# EAGLE design PIN2DMD_PWR (EAGLE 7.4.0)
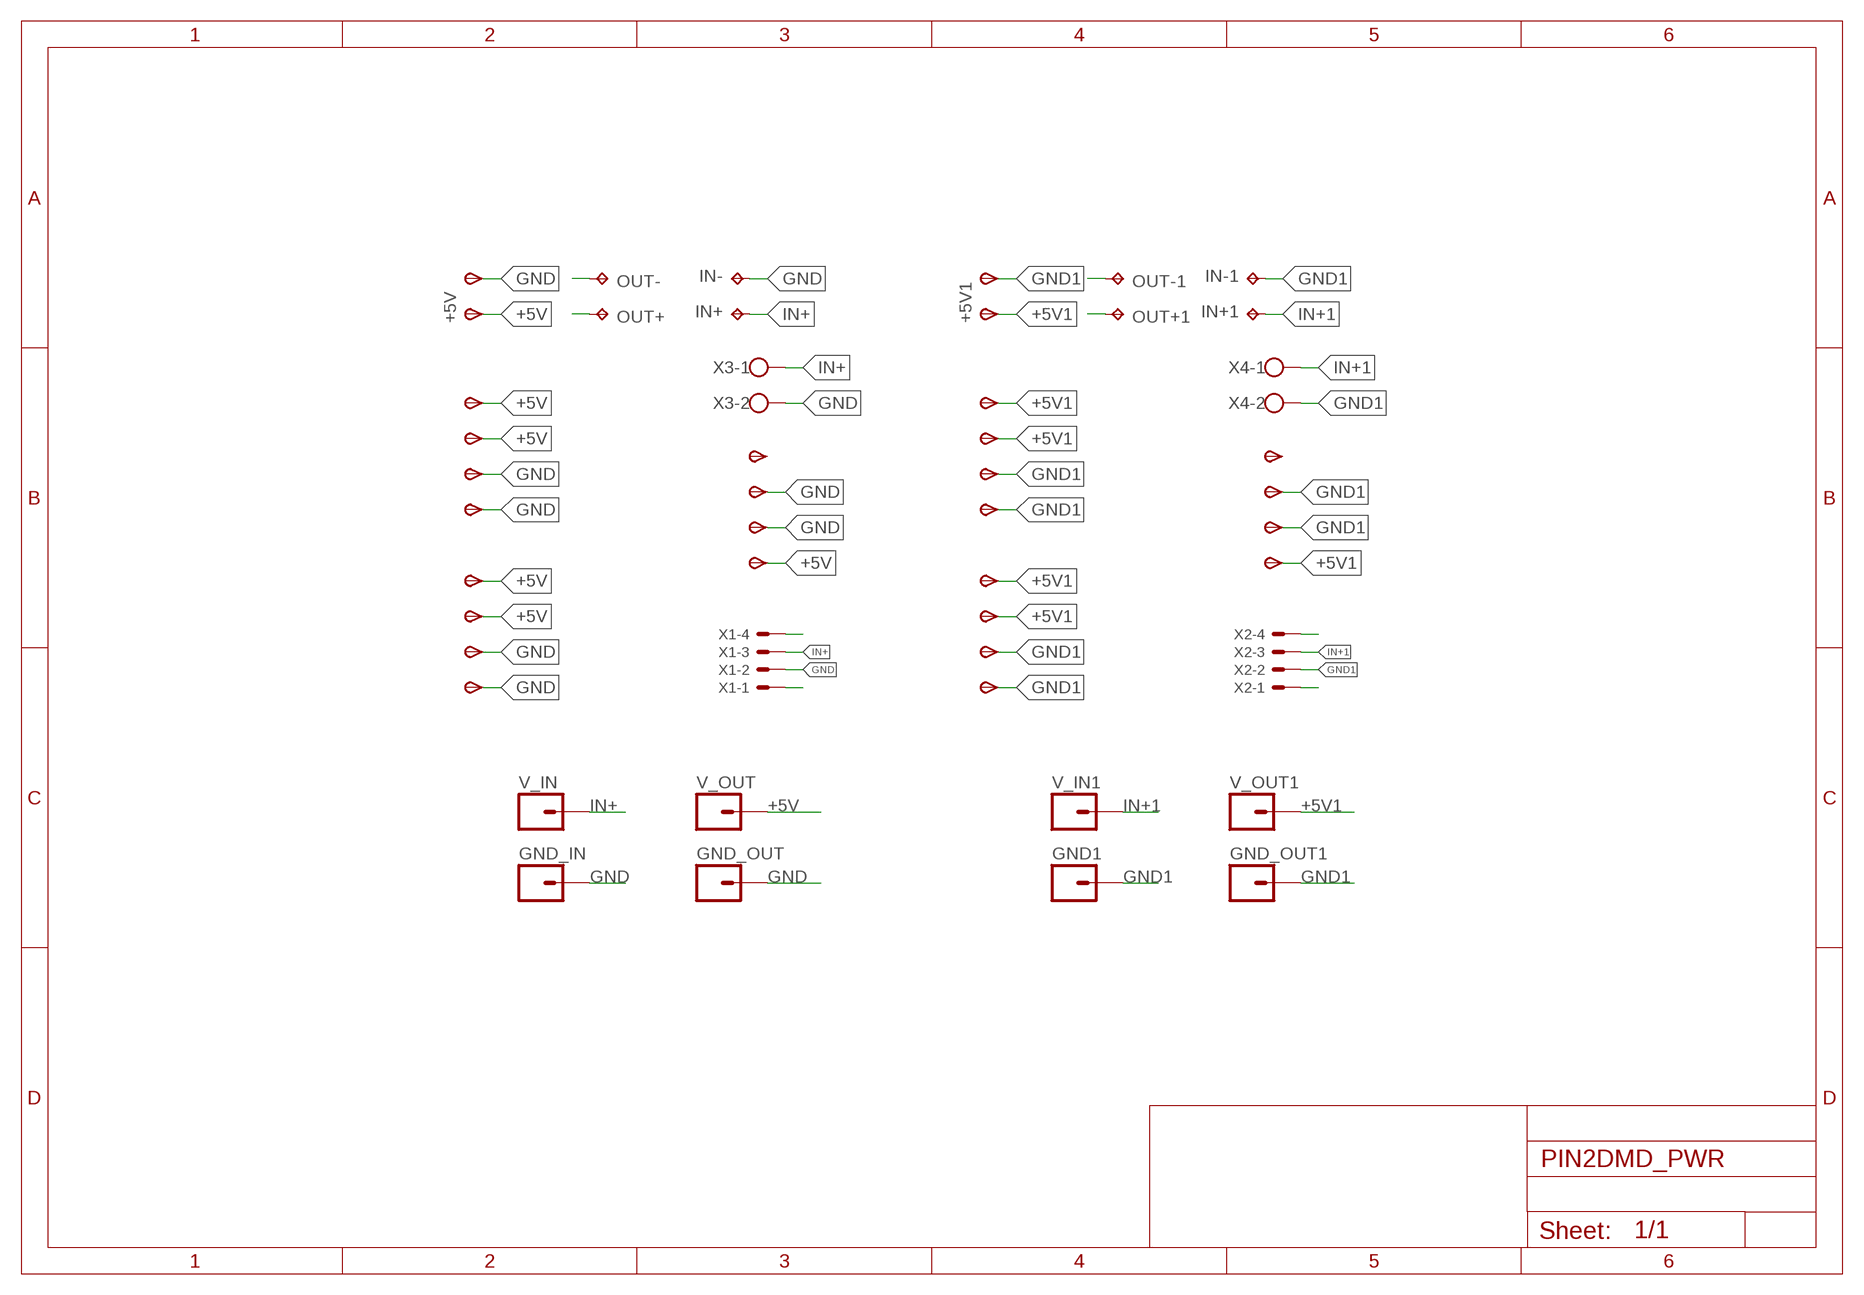
[diagram p0: schematic, sheet 1]

## Parts
+5V  TPSPAD1-20Y  [P1-20Y]
+5V1  TPSPAD1-20Y  [P1-20Y]
GND1  M01PTH  [1X01]
GND_IN  M01PTH  [1X01]
GND_OUT  M01PTH  [1X01]
GND_OUT1  M01PTH  [1X01]
IN+  TPPAD1-20  [P1-20]
IN+1  TPPAD1-20  [P1-20]
IN-  TPPAD1-20  [P1-20]
IN-1  TPPAD1-20  [P1-20]
OUT+  TPPAD1-20  [P1-20]
OUT+1  TPPAD1-20  [P1-20]
OUT-  TPPAD1-20  [P1-20]
OUT-1  TPPAD1-20  [P1-20]
TP1  TPSPAD1-20Y  [P1-20Y]
TP2  TPSPAD1-20Y  [P1-20Y]
TP3  TPSPAD1-20Y  [P1-20Y]
TP4  TPSPAD1-20Y  [P1-20Y]
TP5  TPSPAD1-20Y  [P1-20Y]
TP6  TPSPAD1-20Y  [P1-20Y]
TP7  TPSPAD1-20Y  [P1-20Y]
TP8  TPSPAD1-20Y  [P1-20Y]
TP9  TPSPAD1-20Y  [P1-20Y]
TP10  TPSPAD1-20Y  [P1-20Y]
TP11  TPSPAD1-20Y  [P1-20Y]
TP12  TPSPAD1-20Y  [P1-20Y]
TP13  TPSPAD1-20Y  [P1-20Y]
TP14  TPSPAD1-20Y  [P1-20Y]
TP15  TPSPAD1-20Y  [P1-20Y]
TP16  TPSPAD1-20Y  [P1-20Y]
TP17  TPSPAD1-20Y  [P1-20Y]
TP18  TPSPAD1-20Y  [P1-20Y]
TP19  TPSPAD1-20Y  [P1-20Y]
TP20  TPSPAD1-20Y  [P1-20Y]
TP21  TPSPAD1-20Y  [P1-20Y]
TP22  TPSPAD1-20Y  [P1-20Y]
TP23  TPSPAD1-20Y  [P1-20Y]
TP24  TPSPAD1-20Y  [P1-20Y]
TP25  TPSPAD1-20Y  [P1-20Y]
TP26  TPSPAD1-20Y  [P1-20Y]
V_IN  M01PTH  [1X01]
V_IN1  M01PTH  [1X01]
V_OUT  M01PTH  [1X01]
V_OUT1  M01PTH  [1X01]
X1  KK-156-4  [KK-156-4]
X2  KK-156-4  [KK-156-4]
X3  W237-102  [W237-102]
X4  W237-102  [W237-102]

## Nets
+5V: +5V.TP(PP) OUT+.TP TP5.TP(PP) TP6.TP(PP) TP7.TP(PP) TP8.TP(PP) TP13.TP(PP) V_OUT.1
+5V1: +5V1.TP(PP) OUT+1.TP TP17.TP(PP) TP18.TP(PP) TP19.TP(PP) TP20.TP(PP) TP26.TP(PP) V_OUT1.1
GND: GND_IN.1 GND_OUT.1 IN-.TP OUT-.TP TP1.TP(PP) TP3.TP(PP) TP4.TP(PP) TP9.TP(PP) TP10.TP(PP) TP11.TP(PP) TP12.TP(PP) X1.2 X3.2
GND1: GND1.1 GND_OUT1.1 IN-1.TP OUT-1.TP TP14.TP(PP) TP15.TP(PP) TP16.TP(PP) TP21.TP(PP) TP22.TP(PP) TP24.TP(PP) TP25.TP(PP) X2.2 X4.2
IN+: IN+.TP V_IN.1 X1.3 X3.1
IN+1: IN+1.TP V_IN1.1 X2.3 X4.1
N$1: X1.1
N$2: X2.1
N$3: X2.4
N$4: X1.4
Unconnected: TP2.TP(PP) TP23.TP(PP)

## Library data of the parts
+5V +5V1 TP1-TP26 = testpad:TPS: TEST PIN
GND1 GND_IN GND_OUT GND_OUT1 V_IN V_IN1 V_OUT V_OUT1 = SparkFun-Connectors:M01: Header 1 Standard 1-pin 0.1" header. Use with straight break away headers (SKU : PRT-00116), right angle break away headers (PRT-00553), swiss pins (PRT-00743), machine pins (PRT-00117), and female headers (PRT-00115). SMTSO-256-ET is a "flush mount" nut for a 4-40 screw. The older package used to be too tight, and did not allow it to sit properly thru the drill hit. The latest (0.165DIA) fits nice and snug.
IN+ IN+1 IN- IN-1 OUT+ OUT+1 OUT- OUT-1 = testpad:TP: Test pad
X1 X2 = con-molex:KK-156-4: KK 156 HEADER Source: http://www.molex.com/pdm_docs/sd/026604100_sd.pdf; OC_FARNELL: unknown; OC_NEWARK: unknown
X3 X4 = con-wago-500:W237-102: WAGO SCREW CLAMP; MPN: 237-102; OC_FARNELL: unknown; OC_NEWARK: 70K9898

## Board
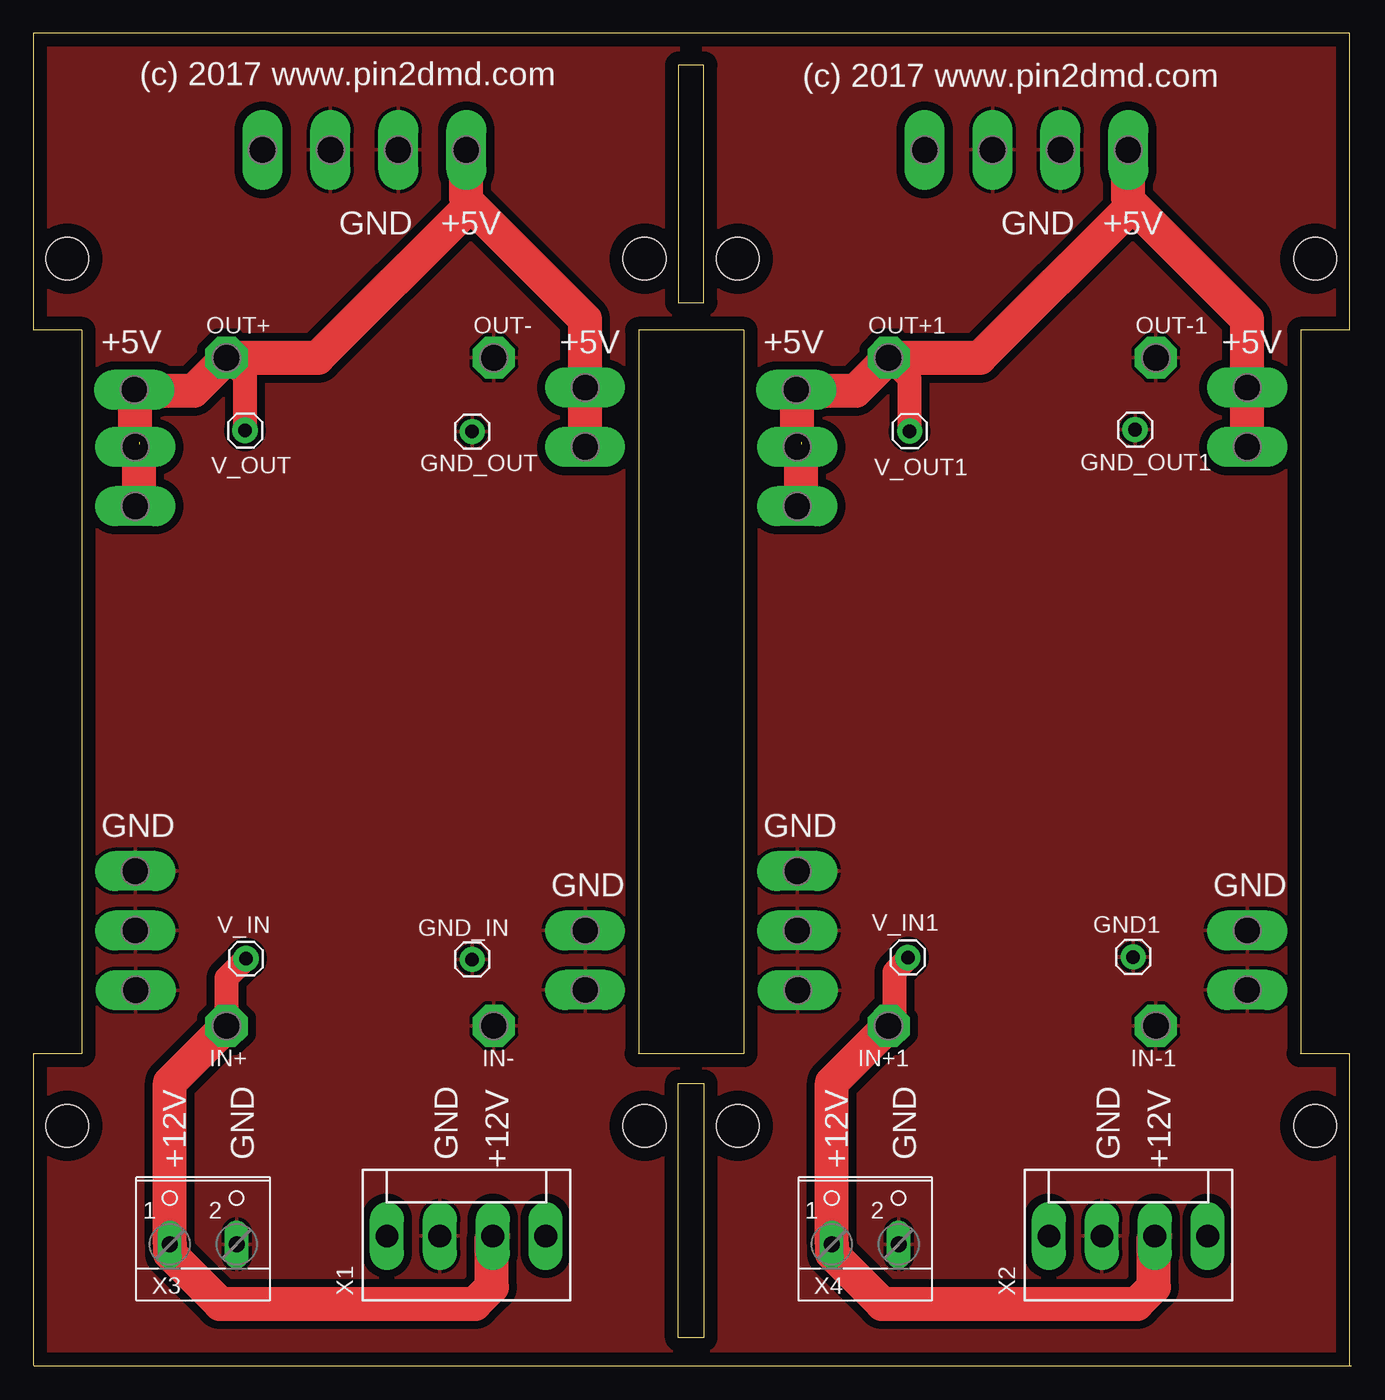
[diagram p1: board, top side]
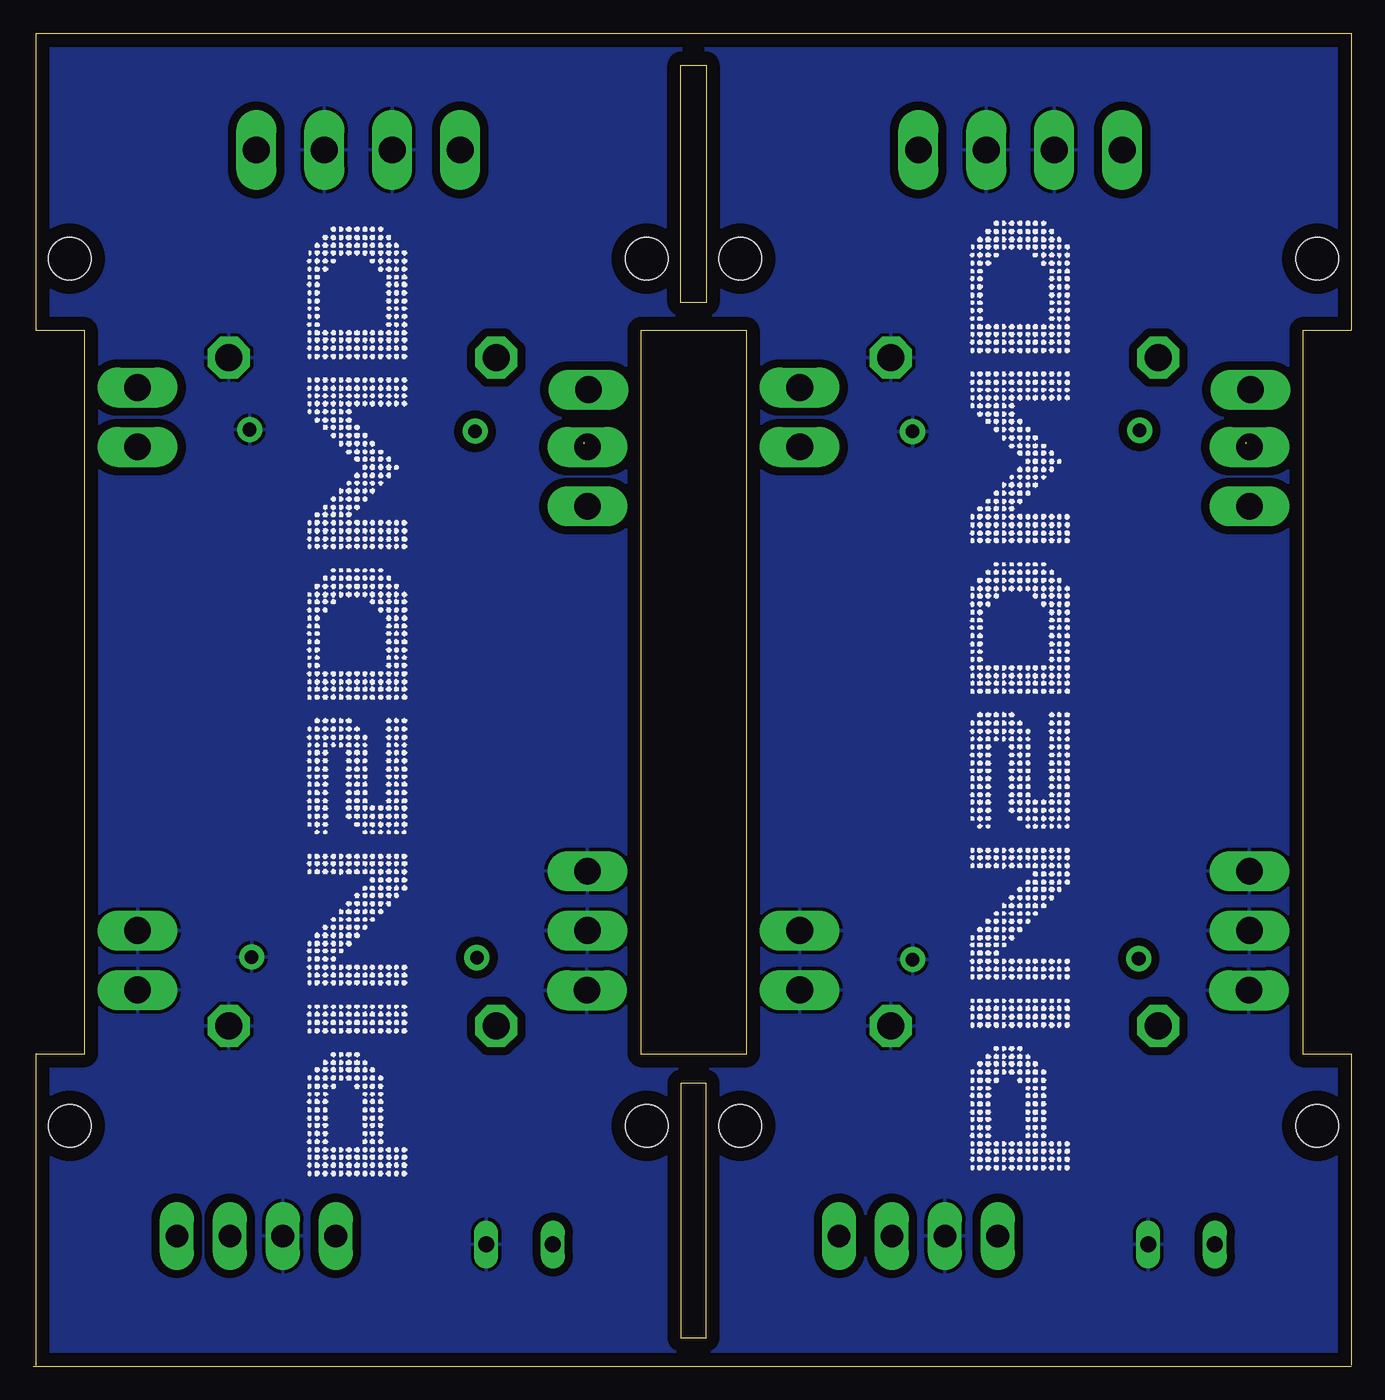
[diagram p2: board, bottom side, seen from below]

Size 98.6 x 99.74 mm. Coordinates in mm from the lower left corner, seen from the top.
Outline: 0,77.53 0,99.74 98.42,99.74 98.42,77.51 94.8,77.51 94.8,23.39
Outline: 98.6,0 0.01,0
Outline: 3.62,23.38 0,23.38 0,0.06
Outline: 0,77.51 3.62,77.51 3.62,23.39
Outline: 45.27,23.39 45.27,77.51 53.15,77.51 53.15,23.39
Outline: 53.15,23.38 45.24,23.38
Outline: 98.42,23.39 98.42,23.38
Outline: 98.42,23.38 98.42,0.06
Outline: 98.42,23.38 94.77,23.38
Outline: 48.26,2.12 48.26,21.17 50.16,21.17 50.16,2.12 48.26,2.12
Outline: 48.26,79.59 50.16,79.59 50.16,97.37 48.26,97.37 48.26,79.59
Copper layers (1*16): Top 0.035mm / dielectric 1.5mm / Bottom 0.035mm
Design rules "default": minimum track width 10mil, minimum drill 24mil, track to track 8mil, track to pad 8mil, pad to pad 8mil, via to via 8mil, smd to smd 8mil, copper to edge 40mil, drill to drill 8mil, minimum pad ring 10mil, minimum via ring 8mil, stop-mask expansion 4mil, vias tented up to drill 0mil, thermal gap 10mil
Holes 3.2 mm at 2.54,82.89 2.54,17.99 45.72,82.89 45.72,17.99 52.7,82.89 52.7,17.99 95.88,82.89 95.88,17.99

### Footprints (pad centres in the part's own frame; a part is rotated, then mirrored left to right if it is on the bottom)
P1-20Y = drill 2.007 pad 2.54 long: TP 0,0
1X01 = drill 1.016 pad 1.88: 1 0,0
P1-20 = drill 2.007 pad 3.15 octagon: TP 0,0
KK-156-4 = drill 1.7 pad 2.184 long: 1 -5.94,0; 2 -1.98,0; 3 1.98,0; 4 5.94,0
W237-102 = drill 1.194 long: 1 -2.5,-1.27; 2 2.5,-1.27

### Placement (x,y rotation side)
+5V  7.55,73.07 90 top
+5V1  57.08,73.07 90 top
GND1  82.27,30.61 90 top
GND_IN  32.82,30.42 90 top
GND_OUT  32.83,69.95 270 top
GND_OUT1  82.41,70.08 270 top
IN+  14.45,25.46 180 top
IN+1  63.98,25.46 180 top
IN-  34.45,25.46 180 top
IN-1  83.98,25.46 180 top
OUT+  14.45,75.46 0 top
OUT+1  63.98,75.46 0 top
OUT-  34.45,75.46 0 top
OUT-1  83.98,75.46 0 top
TP1  7.66,28.13 90 top
TP2  17.14,91.02 0 top
TP3  7.62,32.6 90 top
TP4  7.62,37.04 90 top
TP5  7.62,64.35 90 top
TP6  7.62,68.79 90 top
TP7  41.28,68.79 90 top
TP8  41.28,73.24 90 top
TP9  41.28,32.6 90 top
TP10  41.28,28.15 90 top
TP11  22.22,91.02 0 top
TP12  27.31,91.02 0 top
TP13  32.39,91.02 0 top
TP14  57.19,28.13 90 top
TP15  57.15,32.6 90 top
TP16  57.15,37.04 90 top
TP17  57.15,64.35 90 top
TP18  57.15,68.79 90 top
TP19  90.8,68.79 90 top
TP20  90.8,73.24 90 top
TP21  90.8,32.6 90 top
TP22  90.8,28.15 90 top
TP23  66.67,91.02 0 top
TP24  71.75,91.02 0 top
TP25  76.83,91.02 0 top
TP26  81.91,91.02 0 top
V_IN  15.9,30.49 90 top
V_IN1  65.42,30.57 180 top
V_OUT  15.83,70.03 270 top
V_OUT1  65.55,69.96 270 top
X1  32.39,9.74 0 top
X2  81.91,9.74 0 top
X3  12.7,10.37 0 top
X4  62.23,10.37 0 top

### Tracks (layer width: path | path; a pad name or v marks a point on that pad's centre or on a via)
+5V  (1 unrouted)
  Top 0.254: 7.91,64.5 TP5.TP | 7.91,68.5 TP6.TP 7.91,69 | 7.91,73 +5V.TP | 41.41,69 TP7.TP | 32.41,91 TP13.TP
  Top 1.27: 32.41,90.99 TP13.TP
  Top 1.778: V_OUT.1 15.83,74.08 OUT+.TP
  Top 2.54: 7.91,64.5 7.91,69.14 7.62,69.43 7.62,73 +5V.TP | 7.91,73 11.98,73 OUT+.TP 21.27,75.46 32.7,86.89 | 41.41,69 41.28,69.13 TP8.TP 41.28,78.32 32.7,86.89 | 32.7,86.89 32.39,87.21 TP13.TP
+5V1  (1 unrouted)
  Top 0.254: 57.44,64.5 TP17.TP | 57.44,68.5 TP18.TP 57.44,69 | 57.44,73 +5V1.TP | 90.94,69 TP19.TP | 81.94,91 TP26.TP
  Top 1.27: 81.94,90.99 TP26.TP
  Top 1.778: V_OUT1.1 65.55,73.89 OUT+1.TP
  Top 2.54: 57.44,64.5 57.44,69.14 57.15,69.43 57.15,73 +5V1.TP | 57.44,73 61.51,73 OUT+1.TP 70.8,75.46 82.23,86.89 | 90.94,69 90.8,69.13 TP20.TP 90.8,78.32 82.23,86.89 | 82.23,86.89 81.91,87.21 TP26.TP
GND
  Top 0.254: 22.41,91 TP11.TP | 26.91,91 TP12.TP | 7.91,37 TP4.TP | 7.91,33 TP3.TP
  pour Top (isolate 0.61): 48.26,99.91 0,99.91 0,0.21 48.26,0.21
  pour Bottom (isolate 0.61): 0,99.91 48.26,99.91 48.26,0.21 0,0.21
GND1
  Top 0.254: 71.94,91 TP24.TP | 76.44,91 TP25.TP | 57.44,37 TP16.TP | 57.44,33 TP15.TP
  pour Top (isolate 0.61): 98.42,99.91 50.16,99.91 50.16,0.21 98.42,0.21
  pour Bottom (isolate 0.61): 50.16,99.91 98.42,99.91 98.42,0.21 50.16,0.21
IN+
  Top 1.778: IN+.TP 14.45,29.03 V_IN.1
  Top 2.54: X1.3 34.29,9.66 34.29,5.93 33.02,4.66 13.97,4.66 10.2,8.43 X3.1 10.2,21.21 IN+.TP
IN+1
  Top 1.778: V_IN1.1 65.42,30.51 64.41,29.5 64.41,25.89 IN+1.TP
  Top 2.54: X2.3 83.82,9.66 83.82,5.93 82.55,4.66 63.5,4.66 59.73,8.43 X4.1 59.73,21.21 IN+1.TP

### Text on the board
tNames: (c) 2017 www.pin2dmd.com | (c) 2017 www.pin2dmd.com | GND | +5V | GND | +5V | +5V | +5V | +5V | +5V | GND | GND | GND | GND | GND | GND | GND | GND | +12V | +12V | +12V | +12V
201bmp: F:/hub75e_P2.bmp